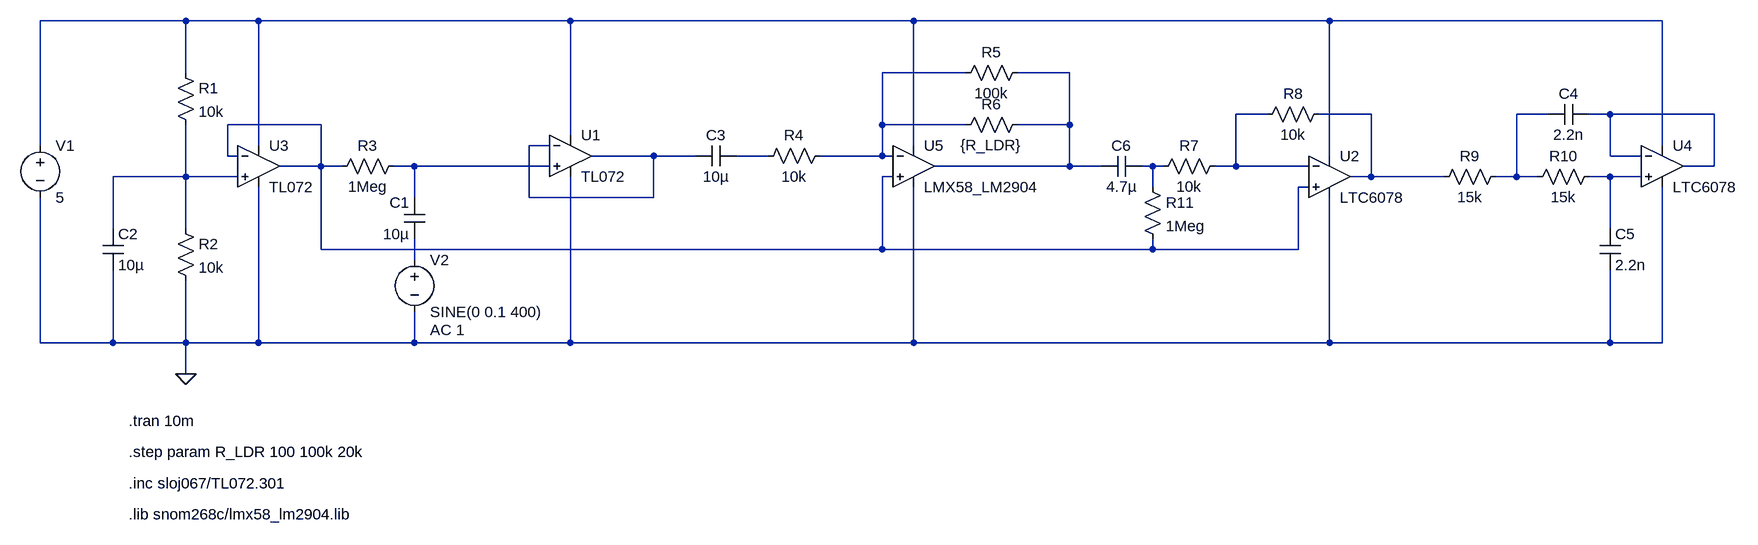
[diagram p0: schematic Full_Circuit.asc]
Full_Circuit.asc, the LTspice schematic file:
Version 4.1
SHEET 1 2456 904
WIRE -304 -80 -528 -80
WIRE -192 -80 -304 -80
WIRE 288 -80 -192 -80
WIRE 816 -80 288 -80
WIRE 1456 -80 816 -80
WIRE 1968 -80 1456 -80
WIRE -304 0 -304 -80
WIRE 896 0 768 0
WIRE 1056 0 976 0
WIRE 1360 64 1312 64
WIRE 1520 64 1440 64
WIRE 1792 64 1744 64
WIRE 1888 64 1856 64
WIRE 2048 64 1888 64
WIRE -96 80 -240 80
WIRE 768 80 768 0
WIRE 896 80 768 80
WIRE 1056 80 1056 0
WIRE 1056 80 976 80
WIRE 288 96 288 -80
WIRE -528 112 -528 -80
WIRE -192 112 -192 -80
WIRE 256 112 224 112
WIRE 816 112 816 -80
WIRE 1968 112 1968 -80
WIRE -240 128 -240 80
WIRE -224 128 -240 128
WIRE 416 128 320 128
WIRE 480 128 416 128
WIRE 592 128 544 128
WIRE 768 128 768 80
WIRE 768 128 672 128
WIRE 784 128 768 128
WIRE 1456 128 1456 -80
WIRE 1888 128 1888 64
WIRE 1936 128 1888 128
WIRE -96 144 -96 80
WIRE -96 144 -160 144
WIRE -64 144 -96 144
WIRE 48 144 16 144
WIRE 256 144 48 144
WIRE 1056 144 1056 80
WIRE 1056 144 848 144
WIRE 1104 144 1056 144
WIRE 1184 144 1168 144
WIRE 1200 144 1184 144
WIRE 1312 144 1312 64
WIRE 1312 144 1280 144
WIRE 1424 144 1312 144
WIRE 2048 144 2048 64
WIRE 2048 144 2000 144
WIRE -304 160 -304 80
WIRE -304 160 -416 160
WIRE -224 160 -304 160
WIRE 784 160 768 160
WIRE 1520 160 1520 64
WIRE 1520 160 1488 160
WIRE 1632 160 1520 160
WIRE 1744 160 1744 64
WIRE 1744 160 1712 160
WIRE 1776 160 1744 160
WIRE 1888 160 1856 160
WIRE 1936 160 1888 160
WIRE 1184 176 1184 144
WIRE 1424 176 1408 176
WIRE 48 192 48 144
WIRE 224 192 224 112
WIRE 416 192 416 128
WIRE 416 192 224 192
WIRE -416 240 -416 160
WIRE -304 240 -304 160
WIRE 1888 240 1888 160
WIRE -96 272 -96 144
WIRE 768 272 768 160
WIRE 768 272 -96 272
WIRE 1184 272 1184 256
WIRE 1184 272 768 272
WIRE 1408 272 1408 176
WIRE 1408 272 1184 272
WIRE 48 288 48 256
WIRE -528 416 -528 192
WIRE -416 416 -416 304
WIRE -416 416 -528 416
WIRE -304 416 -304 320
WIRE -304 416 -416 416
WIRE -192 416 -192 176
WIRE -192 416 -304 416
WIRE 48 416 48 368
WIRE 48 416 -192 416
WIRE 288 416 288 160
WIRE 288 416 48 416
WIRE 816 416 816 176
WIRE 816 416 288 416
WIRE 1456 416 1456 192
WIRE 1456 416 816 416
WIRE 1888 416 1888 304
WIRE 1888 416 1456 416
WIRE 1968 416 1968 176
WIRE 1968 416 1888 416
WIRE -304 464 -304 416
FLAG -304 464 0
SYMBOL voltage -528 96 R0
WINDOW 123 0 0 Left 0
WINDOW 39 0 0 Left 0
SYMATTR InstName V1
SYMATTR Value 5
SYMBOL voltage 48 272 R0
WINDOW 123 24 124 Left 2
WINDOW 39 0 0 Left 0
SYMATTR Value2 AC 1
SYMATTR InstName V2
SYMATTR Value SINE(0 0.1 400)
SYMBOL res -320 -16 R0
SYMATTR InstName R1
SYMATTR Value 10k
SYMBOL res -320 224 R0
SYMATTR InstName R2
SYMATTR Value 10k
SYMBOL res -80 160 R270
WINDOW 0 32 56 VTop 2
WINDOW 3 0 56 VBottom 2
SYMATTR InstName R3
SYMATTR Value 1Meg
SYMBOL cap 64 256 R180
WINDOW 0 24 56 Left 2
WINDOW 3 24 8 Left 2
SYMATTR InstName C1
SYMATTR Value 10µ
SYMBOL OpAmps\\opamp2 288 64 R0
SYMATTR InstName U1
SYMATTR Value TL072
SYMBOL res 688 112 R90
WINDOW 0 0 56 VBottom 2
WINDOW 3 32 56 VTop 2
SYMATTR InstName R4
SYMATTR Value 10k
SYMBOL res 992 -16 R90
WINDOW 0 0 56 VBottom 2
WINDOW 3 32 56 VTop 2
SYMATTR InstName R5
SYMATTR Value 100k
SYMBOL res 992 64 R90
WINDOW 0 0 56 VBottom 2
WINDOW 3 32 56 VTop 2
SYMATTR InstName R6
SYMATTR Value {R_LDR}
SYMBOL res 1296 128 R90
WINDOW 0 0 56 VBottom 2
WINDOW 3 32 56 VTop 2
SYMATTR InstName R7
SYMATTR Value 10k
SYMBOL res 1456 48 R90
WINDOW 0 0 56 VBottom 2
WINDOW 3 32 56 VTop 2
SYMATTR InstName R8
SYMATTR Value 10k
SYMBOL cap 1856 48 R90
WINDOW 0 0 32 VBottom 2
WINDOW 3 32 32 VTop 2
SYMATTR InstName C4
SYMATTR Value 2.2n
SYMBOL cap 1872 240 R0
SYMATTR InstName C5
SYMATTR Value 2.2n
SYMBOL res 1728 144 R90
WINDOW 0 0 56 VBottom 2
WINDOW 3 32 56 VTop 2
SYMATTR InstName R9
SYMATTR Value 15k
SYMBOL res 1872 144 R90
WINDOW 0 0 56 VBottom 2
WINDOW 3 32 56 VTop 2
SYMATTR InstName R10
SYMATTR Value 15k
SYMBOL OpAmps\\LTC6078 1968 144 R0
SYMATTR InstName U4
SYMBOL OpAmps\\opamp2 816 80 R0
SYMATTR InstName U5
SYMATTR Value LMX58_LM2904
SYMBOL OpAmps\\LTC6078 1456 160 R0
SYMATTR InstName U2
SYMBOL OpAmps\\opamp2 -192 80 R0
SYMATTR InstName U3
SYMATTR Value TL072
SYMBOL cap -432 240 R0
SYMATTR InstName C2
SYMATTR Value 10µ
SYMBOL cap 544 112 R90
WINDOW 0 0 32 VBottom 2
WINDOW 3 32 32 VTop 2
SYMATTR InstName C3
SYMATTR Value 10µ
SYMBOL cap 1168 128 R90
WINDOW 0 0 32 VBottom 2
WINDOW 3 32 32 VTop 2
SYMATTR InstName C6
SYMATTR Value 4.7µ
SYMBOL res 1168 160 R0
SYMATTR InstName R11
SYMATTR Value 1Meg
TEXT -392 536 Left 2 !.tran 10m
TEXT -392 632 Left 2 !.inc sloj067/TL072.301
TEXT -392 584 Left 2 !.step param R_LDR 100 100k 20k
TEXT -392 680 Left 2 !.lib snom268c/lmx58_lm2904.lib

The netlist it stands for:
* Full_Circuit.asc
V1 N001 0 5
V2 N015 0 SINE(0 0.1 400) AC 1
R1 N001 N013 10k
R2 N013 0 10k
R3 N008 N011 1Meg
C1 N015 N011 10µ
X§U1 N011 N009 N001 0 N009 TL072  ; pins In+ In- V+ V- OUT
R4 N002 N010 10k
R5 N003 N002 100k
R6 N003 N002 {R_LDR}
R7 N004 N012 10k
R8 N005 N004 10k
C4 N007 N006 2.2n
C5 N014 0 2.2n
R9 N006 N005 15k
R10 N014 N006 15k
X§U4 N014 N007 N001 0 N007 LTC6078  ; pins IN+ IN- VCC VEE OUT
X§U5 N008 N002 N001 0 N003 LMX58_LM2904  ; pins In+ In- V+ V- OUT
X§U2 N008 N004 N001 0 N005 LTC6078  ; pins IN+ IN- VCC VEE OUT
X§U3 N013 N008 N001 0 N008 TL072  ; pins In+ In- V+ V- OUT
C2 N013 0 10µ
C3 N010 N009 10µ
C6 N012 N003 4.7µ
R11 N012 N008 1Meg
.tran 10m
.inc sloj067/TL072.301
.step param R_LDR 100 100k 20k
.lib snom268c/lmx58_lm2904.lib
.lib LTC5.lib
.backanno
.end